# EAGLE design Supply_Voltage_pcb (EAGLE 9.6.2)
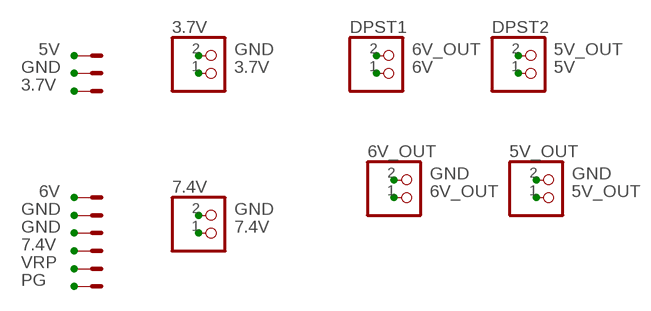
[diagram p0: schematic, sheet 1]

## Parts
3.7V  JST_2PIN-THM  [JST-PH-2-THM]
5V_OUT  JST_2PIN-THM  [JST-PH-2-THM]
6V_OUT  JST_2PIN-THM  [JST-PH-2-THM]
7.4V  JST_2PIN-THM  [JST-PH-2-THM]
DPST1  JST_2PIN-THM  [JST-PH-2-THM]
DPST2  JST_2PIN-THM  [JST-PH-2-THM]
VC-3.7V-5V  22-23-2031  [22-23-2031]
VC-7.4V-6V  22-23-2061  [22-23-2061]

## Nets
3.7V: 3.7V.1 VC-3.7V-5V.3
5V: DPST2.1 VC-3.7V-5V.1
5V_OUT: 5V_OUT.1 DPST2.2
6V: DPST1.1 VC-7.4V-6V.1
6V_OUT: 6V_OUT.1 DPST1.2
7.4V: 7.4V.1 VC-7.4V-6V.4
GND: 3.7V.2 5V_OUT.2 6V_OUT.2 7.4V.2 VC-3.7V-5V.2 VC-7.4V-6V.2 VC-7.4V-6V.3
PG: VC-7.4V-6V.6
VRP: VC-7.4V-6V.5

## Library data of the parts
3.7V 5V_OUT 6V_OUT 7.4V DPST1 DPST2 = adafruit:JST_2PIN: JST 2-Pin Connectors of various flavors SMT-RA (S2B-PH-SM4) 4UConnector #17311 SMT (B2B-PH-SM4) THM-RA (S2B-PH) THM (B2B-PH)
VC-3.7V-5V = con-molex:22-23-2031: .100" (2.54mm) Center Header - 3 Pin; MF: MOLEX; MPN: 22-23-2031; OC_FARNELL: 1462950; OC_NEWARK: 30C0862
VC-7.4V-6V = con-molex:22-23-2061: .100" (2.54mm) Center Header - 6 Pin; MF: MOLEX; MPN: 22-23-2061; OC_FARNELL: 1462922; OC_NEWARK: 27C1933

## Board
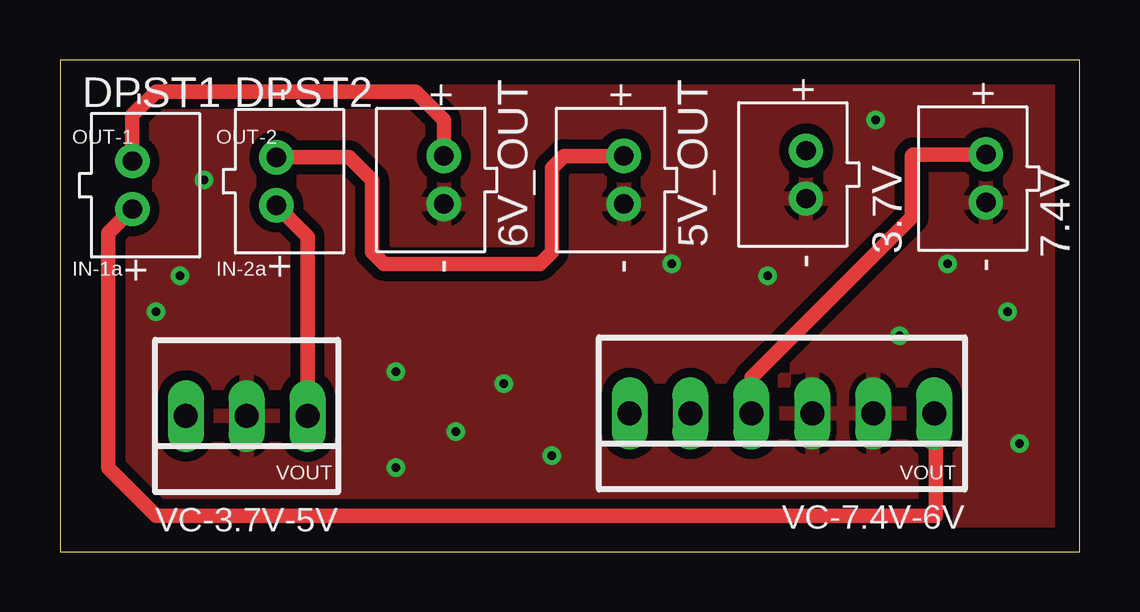
[diagram p1: board, top side]
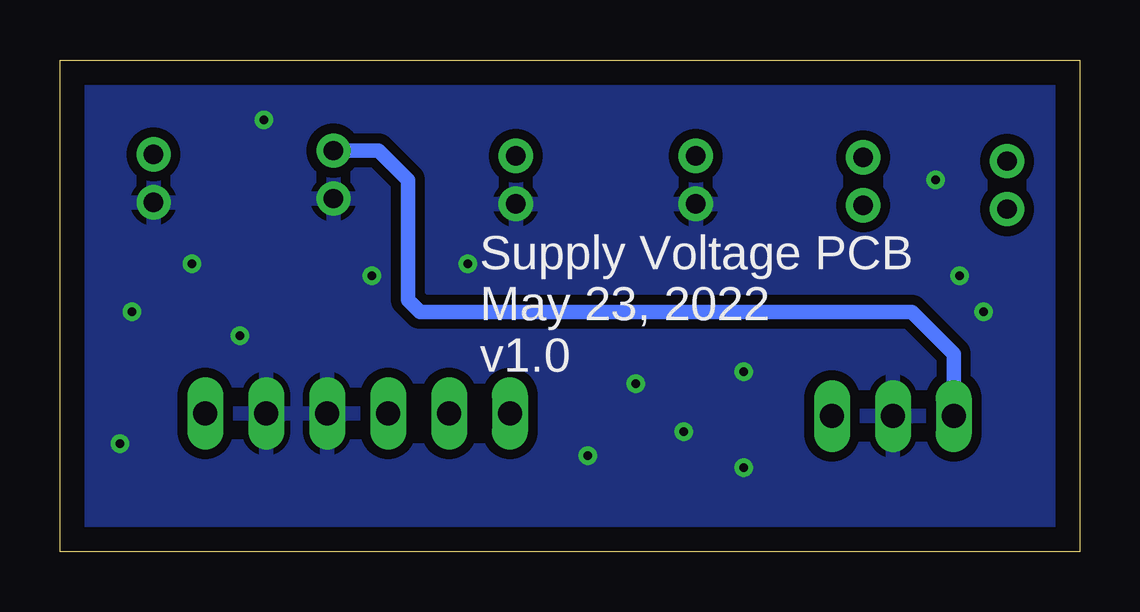
[diagram p2: board, bottom side, seen from below]

Size 42.5 x 20.5 mm. Coordinates in mm from the lower left corner, seen from the top.
Outline: 0,0 42.5,0 42.5,20.5 0,20.5 0,0
Copper layers (1*16): Top 0.035mm / dielectric 1.5mm / Bottom 0.035mm
Design rules "default": minimum track width 6mil, minimum drill 0.35mm, track to track 6mil, track to pad 6mil, pad to pad 6mil, via to via 6mil, smd to smd 6mil, copper to edge 40mil, drill to drill 6mil, minimum pad ring 10mil, minimum via ring 8mil, stop-mask expansion 4mil, vias tented up to drill 0mil, thermal gap 10mil

### Footprints (pad centres in the part's own frame; a part is rotated, then mirrored left to right if it is on the bottom)
JST-PH-2-THM = drill 0.8 pad 1.422: 1 1,0; 2 -1,0
22-23-2031 = drill 1 long: 1 -2.54,0; 2 0,0; 3 2.54,0
22-23-2061 = drill 1 long: 1 -6.35,0; 2 -3.81,0; 3 -1.27,0; 4 1.27,0; 5 3.81,0; 6 6.35,0

### Placement (x,y rotation side)
3.7V  31.1,15.72 90 top
5V_OUT  23.5,15.5 90 top
6V_OUT  16,15.5 90 top
7.4V  38.6,15.56 90 top
DPST1  3.02,15.28 270 top
DPST2  9.02,15.44 270 top
VC-3.7V-5V  7.78,5.65 180 top
VC-7.4V-6V  30.09,5.76 180 top

### Tracks (layer width: path | path; a pad name or v marks a point on that pad's centre or on a via)
3.7V
  Bottom 0.61: VC-3.7V-5V.3 5.24,8.24 7,10 27.5,10 28,10.5 28,15.5 29.22,16.72 3.7V.1
5V
  Top 0.61: VC-3.7V-5V.1 10.32,13.14 DPST2.1
5V_OUT
  Top 0.61: DPST2.2 12.06,16.44 13,15.5 13,12.5 13.5,12 20,12 20.5,12.5 20.5,16 21,16.5 5V_OUT.1
6V
  Top 0.61: DPST1.1 2.02,13.28 2.02,3.48 4,1.5 36.5,1.5 36.5,5.7 VC-7.4V-6V.1
6V_OUT
  Top 0.61: DPST1.2 3.02,18.2 4,19.18 14.82,19.18 16,18 6V_OUT.1
7.4V
  Top 0.61: VC-7.4V-6V.4 28.82,7.26 35.5,13.94 35.5,16.5 35.56,16.56 7.4V.1
GND  (via drill 0.35)
  other vias: 6,15.5 5,11.5 4,10 14,7.5 14,3.5 16.5,5 18.5,7 20.5,4 25.5,12 29.5,11.5 34,18 37,12 35,9 39.5,10 40,4.5
  pour Bottom (isolate 0.406): 0,20.5 42.5,20.5 42.5,0 0,0
  pour Top (isolate 0.406): 0,20.5 42.5,20.5 42.5,0 0,0

### Text on the board
tPlace: OUT-1 | OUT-2 | IN-1a | IN-2a | VOUT | VOUT
bPlace: Supply Voltage PCB / May 23, 2022 / v1.0